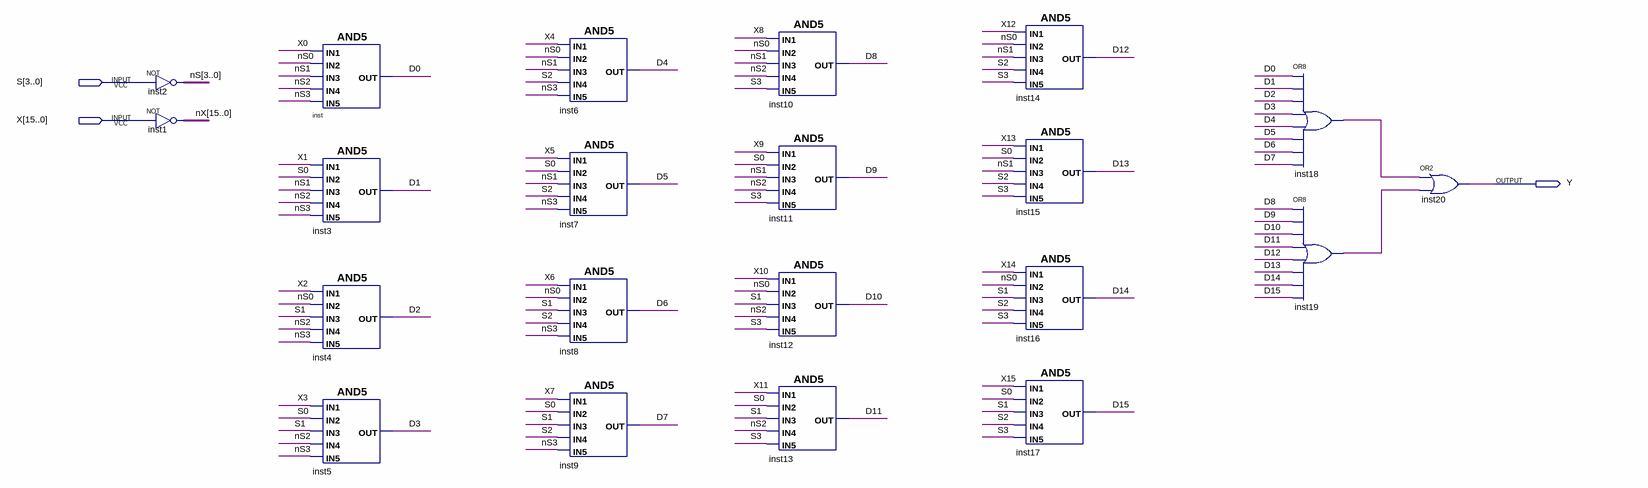
[diagram p0: schematic sheet]
// Quartus schematic MP16.bdf as structural Verilog: 21 symbols, 3 pins
module MP16 (
  input  [3:0] S,
  input  [15:0] X,
  output Y
);

  wire D0, D1, D2, D3, D4, D5, D6, D7, D8, D9, D10, D11, D12, D13, D14, D15, inst18_out, inst19_out;
  wire [3:0] nS;
  wire [15:0] nX;

  assign nS = ~S;  // NOT inst2, 4 bits wide
  assign nX = ~X;  // NOT inst1, 16 bits wide
  and inst (D0, X[0], nS[0], nS[1], nS[2], nS[3]);
  and inst3 (D1, X[1], S[0], nS[1], nS[2], nS[3]);
  and inst4 (D2, X[2], nS[0], S[1], nS[2], nS[3]);
  and inst5 (D3, X[3], S[0], S[1], nS[2], nS[3]);
  and inst6 (D4, X[4], nS[0], nS[1], S[2], nS[3]);
  and inst7 (D5, X[5], S[0], nS[1], S[2], nS[3]);
  and inst8 (D6, X[6], nS[0], S[1], S[2], nS[3]);
  and inst9 (D7, X[7], S[0], S[1], S[2], nS[3]);
  and inst10 (D8, X[8], nS[0], nS[1], nS[2], S[3]);
  and inst11 (D9, X[9], S[0], nS[1], nS[2], S[3]);
  and inst12 (D10, X[10], nS[0], S[1], nS[2], S[3]);
  and inst13 (D11, X[11], S[0], S[1], nS[2], S[3]);
  and inst14 (D12, X[12], nS[0], nS[1], S[2], S[3]);
  and inst15 (D13, X[13], S[0], nS[1], S[2], S[3]);
  and inst16 (D14, X[14], nS[0], S[1], S[2], S[3]);
  and inst17 (D15, X[15], S[0], S[1], S[2], S[3]);
  or inst18 (inst18_out, D0, D1, D2, D3, D4, D5, D6, D7);
  or inst19 (inst19_out, D8, D9, D10, D11, D12, D13, D14, D15);
  or inst20 (Y, inst18_out, inst19_out);
endmodule
